# Altium project classyTKL_EC.PrjPcb
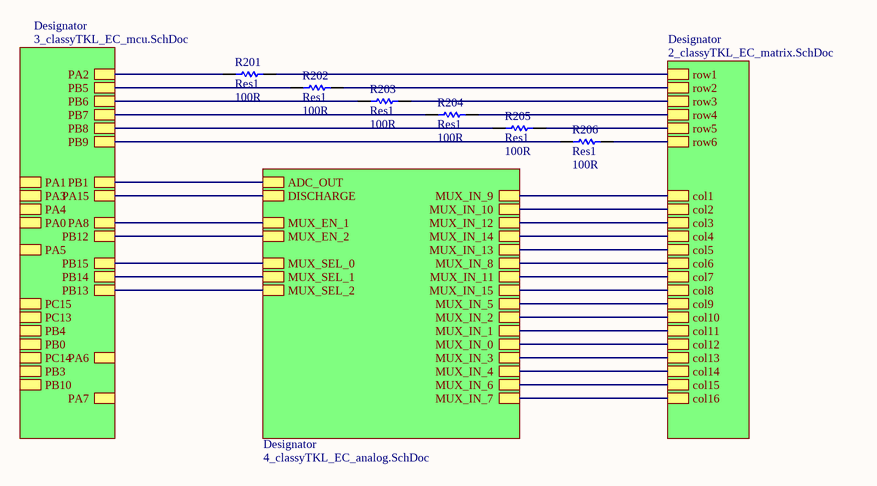
[diagram p0: 1_classyTKL_EC_top.SchDoc]
4 sheets, 156 parts. Net scope: hierarchical (ports join the sheet entries above them; power ports are global).
Board file: classyTKL_EC.PcbDoc
Sheets:
  1_classyTKL_EC_top.SchDoc
    Designator = 3_classyTKL_EC_mcu.SchDoc
    Designator = 2_classyTKL_EC_matrix.SchDoc
    Designator = 4_classyTKL_EC_analog.SchDoc

## Sheet 1_classyTKL_EC_top.SchDoc: ClassyTKL - MX
size A4; Engineer: 4pplet; Address1: github.com/4pplet/classytkl; Address2: Licence: CERN-OHL-S; Revision: A3; SheetNumber: 1; SheetTotal: 3; ProjectName: waffling60

### Parts
R201  Res1  value 100R  [R0603[1608]]
R202  Res1  value 100R  [R0603[1608]]
R203  Res1  value 100R  [R0603[1608]]
R204  Res1  value 100R  [R0603[1608]]
R205  Res1  value 100R  [R0603[1608]]
R206  Res1  value 100R  [R0603[1608]]

### Sub-sheets
Designator = 3_classyTKL_EC_mcu.SchDoc: PB4, PB0, PA0, PA1, PA2, PA3, PA4, PA5, PA15, PB1, PB3, PB5, PB8, PB9, PB10, PB12, PB14, PC13, PC14, PC15, PA8, PA6, PA7, PB6, PB7, PB13, PB15
Designator = 2_classyTKL_EC_matrix.SchDoc: col6, col8, col5, col7, col3, col2, col1, col4, col9, row3, row1, row4, row2, row6, row5, col10, col11, col14, col15, col13, col12, col16
Designator = 4_classyTKL_EC_analog.SchDoc: ADC_OUT, DISCHARGE, MUX_EN_1, MUX_EN_2, MUX_SEL_0, MUX_SEL_1, MUX_SEL_2, MUX_IN_0, MUX_IN_8, MUX_IN_9, MUX_IN_10, MUX_IN_11, MUX_IN_12, MUX_IN_13, MUX_IN_14, MUX_IN_15, MUX_IN_1, MUX_IN_2, MUX_IN_3, MUX_IN_4, MUX_IN_5, MUX_IN_6, MUX_IN_7

### Nets
col1: sheet Designator/col1, sheet Designator/MUX_IN_9
col2: sheet Designator/col2, sheet Designator/MUX_IN_10
col3: sheet Designator/col3, sheet Designator/MUX_IN_12
col4: sheet Designator/col4, sheet Designator/MUX_IN_14
col5: sheet Designator/col5, sheet Designator/MUX_IN_13
col6: sheet Designator/col6, sheet Designator/MUX_IN_8
col7: sheet Designator/col7, sheet Designator/MUX_IN_11
col8: sheet Designator/col8, sheet Designator/MUX_IN_15
col9: sheet Designator/col9, sheet Designator/MUX_IN_5
col10: sheet Designator/col10, sheet Designator/MUX_IN_2
col11: sheet Designator/col11, sheet Designator/MUX_IN_1
col12: sheet Designator/col12, sheet Designator/MUX_IN_0
col13: sheet Designator/col13, sheet Designator/MUX_IN_3
col14: sheet Designator/col14, sheet Designator/MUX_IN_4
col15: sheet Designator/col15, sheet Designator/MUX_IN_6
col16: sheet Designator/col16, sheet Designator/MUX_IN_7
DISCHARGE: sheet Designator/PA15, sheet Designator/DISCHARGE
MUX_EN_1: sheet Designator/PA8, sheet Designator/MUX_EN_1
MUX_EN_2: sheet Designator/PB12, sheet Designator/MUX_EN_2
MUX_SEL_0: sheet Designator/PB15, sheet Designator/MUX_SEL_0
MUX_SEL_1: sheet Designator/PB14, sheet Designator/MUX_SEL_1
MUX_SEL_2: sheet Designator/PB13, sheet Designator/MUX_SEL_2
row1: R201.2 ; sheet Designator/row1
row2: R202.2 ; sheet Designator/row2
row3: R203.2 ; sheet Designator/row3
row4: R204.2 ; sheet Designator/row4
row5: R205.2 ; sheet Designator/row5
row6: R206.2 ; sheet Designator/row6
NetR201_1: R201.1 ; sheet Designator/PA2
NetR202_1: R202.1 ; sheet Designator/PB5
NetR203_1: R203.1 ; sheet Designator/PB6
NetR204_1: R204.1 ; sheet Designator/PB7
NetR205_1: R205.1 ; sheet Designator/PB8
NetR206_1: R206.1 ; sheet Designator/PB9
NetR418_2: sheet Designator/PB1, sheet Designator/ADC_OUT

### Notes on the sheet
- Title
- Size:
- Date:
- A4
- Number:
- Time:
- Revision:
- Sheet
- of
- File:

### Library data of the parts
R201-R206 = Res1: Resistor; MRF.Part: 0603WAF1003T5E; LCSC MFG: Uniroyal Elec; Version: 0603 imperial; LCSC Part #: C25803

## Sheet 3_classyTKL_EC_mcu.SchDoc: =ProjectTitle
size A4; Address1: github.com/4pplet/yakiimo-pcb; Address2: Licence:; SheetNumber: 3; SheetTotal: 3
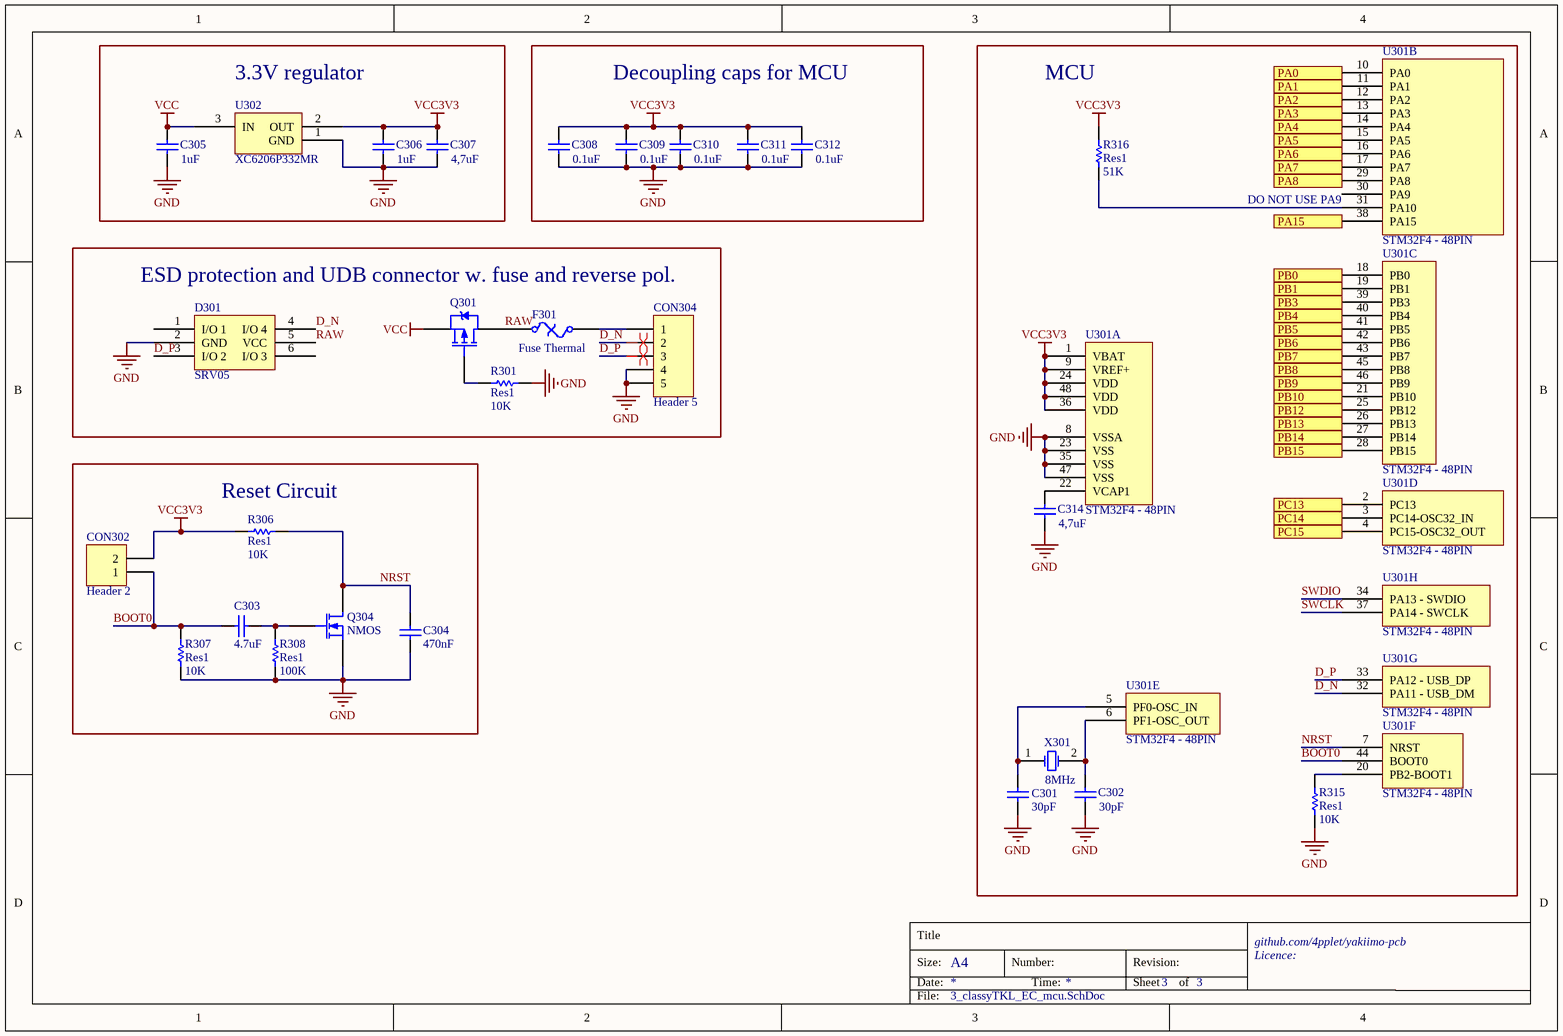
[diagram p1: 3_classyTKL_EC_mcu.SchDoc]

### Parts
C301  value 30pF  [C0603[1608]]
C302  value 30pF  [C0603[1608]]
C303  value 4.7uF  [C0603[1608]]
C304  value 470nF  [C0603[1608]]
C305  value 1uF  [C0603[1608]]
C306  value 1uF  [C0603[1608]]
C307  value 4,7uF  [C0603[1608]]
C308  value 0.1uF  [C0603[1608]]
C309  value 0.1uF  [C0603[1608]]
C310  value 0.1uF  [C0603[1608]]
C311  value 0.1uF  [C0603[1608]]
C312  value 0.1uF  [C0603[1608]]
C314  value 4,7uF  [C0603[1608]]
CON302  Header 2  [HDR1X2]  (no BOM)
CON304  Header 5  [JST SM04B-SRSS-TB]
D301  SRV05  [SOT-23-6]
F301  Fuse Thermal  [C1206[3216]]
Q301  PMOS-2  [SOT-23-3]  (value not drawn)
Q304  NMOS  [SOT-23-3]
R301  Res1  value 10K  [R0603[1608]]
R306  Res1  value 10K  [R0603[1608]]
R307  Res1  value 10K  [R0603[1608]]
R308  Res1  value 100K  [R0603[1608]]
R315  Res1  value 10K  [R0603[1608]]
R316  Res1  value 51K  [R0603[1608]]
U301  STM32F4 - 48PIN  [STM32 - COMBO 7x7mm]  (parts A,B,C,D,E,F,G,H of 8)
U302  XC6206P332MR  [SOT-23-3]
X301  value 8MHz  [CTS 445-series crystal]  (hidden comment: XTAL)

### Blocks framed on the sheet
3.3V regulator: C305-C307 U302
Decoupling caps for MCU: C308-C312
MCU: C301 C302 C314 R315 R316 U301 X301
ESD protection and UDB connector w. fuse and reverse pol.: CON304 D301 F301 Q301 R301
Reset Circuit: C303 C304 CON302 Q304 R306-R308

### Ports
PA0, PA1, PA2, PA3, PA4, PA5, PA6, PA7, PA8, PA15, PB0, PB1, PB3, PB4, PB5, PB6, PB7, PB8, PB9, PB10, PB12, PB13, PB14, PB15, PC13, PC14, PC15

### Nets
GND: C301.1 C302.1 C304.2 C305.1 C306.1 C307.1 C308.1 C309.1 C310.1 C311.1 C312.1 C314.1 CON304.4 CON304.5 D301.2(GND) Q304.2(S) R301.2 R307.2 R308.2 R315.2 U301.8(VSSA) U301.23(VSS) U301.35(VSS) U301.47(VSS) U302.1(GND)
VCC: C305.2 Q301.2(S) U302.3(IN)
VCC3V3: C306.2 C307.2 C308.2 C309.2 C310.2 C311.2 C312.2 CON302.2 R306.1 R316.1 U301.1(VBAT) U301.9(VREF+) U301.24(VDD) U301.36(VDD) U301.48(VDD) U302.2(OUT)
BOOT0: C303.1 CON302.1 R307.1 U301.44(BOOT0)
D_N: CON304.2 D301.4(I/O_4) U301.32(PA11_-_USB_DM)
D_P: CON304.3 D301.3(I/O_2) U301.33(PA12_-_USB_DP)
DISCHARGE: U301.38(PA15) ; port PA15
MUX_EN_1: U301.29(PA8) ; port PA8
MUX_EN_2: U301.25(PB12) ; port PB12
MUX_SEL_0: U301.28(PB15) ; port PB15
MUX_SEL_1: U301.27(PB14) ; port PB14
MUX_SEL_2: U301.26(PB13) ; port PB13
NRST: C304.1 Q304.3(D) R306.2 U301.7(NRST)
RAW: D301.5(VCC) F301.1 Q301.3(D)
SWCLK: U301.37(PA14_-_SWCLK)
SWDIO: U301.34(PA13_-_SWDIO)
NetC301_2: C301.2 U301.5(PF0-OSC_IN) X301.1(OSC1)
NetC302_2: C302.2 U301.6(PF1-OSC_OUT) X301.2(OSC2)
NetC303_2: C303.2 Q304.1(G) R308.1
NetC314_2: C314.2 U301.22(VCAP1)
NetCON304_1: CON304.1 F301.2
NetQ301_1: Q301.1(G) R301.1
NetR201_1: U301.12(PA2) ; port PA2
NetR202_1: U301.41(PB5) ; port PB5
NetR203_1: U301.42(PB6) ; port PB6
NetR204_1: U301.43(PB7) ; port PB7
NetR205_1: U301.45(PB8) ; port PB8
NetR206_1: U301.46(PB9) ; port PB9
NetR315_1: R315.1 U301.20(PB2-BOOT1)
NetR316_2: R316.2 U301.31(PA10)
NetR418_2: U301.19(PB1) ; port PB1
NetU301_2: U301.2(PC13) ; port PC13
NetU301_3: U301.3(PC14-OSC32_IN) ; port PC14
NetU301_4: U301.4(PC15-OSC32_OUT) ; port PC15
NetU301_10: U301.10(PA0) ; port PA0
NetU301_11: U301.11(PA1) ; port PA1
NetU301_13: U301.13(PA3) ; port PA3
NetU301_14: U301.14(PA4) ; port PA4
NetU301_15: U301.15(PA5) ; port PA5
NetU301_16: U301.16(PA6) ; port PA6
NetU301_17: U301.17(PA7) ; port PA7
NetU301_18: U301.18(PB0) ; port PB0
NetU301_21: U301.21(PB10) ; port PB10
NetU301_39: U301.39(PB3) ; port PB3
NetU301_40: U301.40(PB4) ; port PB4

Not connected (* = marked no-connect by the designer): D301 1(I/O_1) 6(I/O_3); U301 30(PA9)

### Layout directives
differential pair: D_N, D_P

### Notes on the sheet
- (near U301) DO NOT USE PA9
- Title
- Size:
- Date:
- A4
- Number:
- Time:
- Revision:
- Sheet
- of
- File:

### Library data of the parts
C301 C302 = Cap: Capacitor; MRF.Part: CL10C300JB8NNNC; LCSC MFG: Samsung Electro-Mechanics; Version: 0603 imperial; LCSC Part #: C22397
C303 C307 C314 = Cap: Capacitor; MRF.Part: CL10A475KO8NNNC; LCSC MFG: Samsung Electro-Mechanics; Version: 0603 imperial; LCSC Part #: C19666
C304 C308-C312 = Cap: Capacitor; MRF.Part: CC0603KRX7R9BB104; LCSC MFG: YAGEO; Version: 0603 imperial; LCSC Part #: C14663
C305 C306 = Cap: Capacitor; MRF.Part: CL10A105KB8NNNC; LCSC MFG: Samsung Electro-Mechanics; Version: 0603 imperial; LCSC Part #: C15849
CON302 = Header 2: Header, 2-Pin; LCSC MFG: DNP; Value: DNP
CON304 = Header 5: JST for USB daughter board; MRF.Part: SM04B-SRSS-TB(LF)(SN); LCSC MFG: JST Sales America; LCSC Part #: C160404
D301 = SRV05: MRF.Part: SRV05-4-P-T7; LCSC MFG: ProTek Devices; LCSC Part #: C85364
F301 = Fuse Thermal: Thermal Fuse; MRF.Part: ASMD1206-050; LCSC MFG: Shenzhen JDT Fuse; LCSC Part #: C135338
Q301 = PMOS-2: P-Channel Power MOSFET; MRF.Part: SI2301CDS-T1-GE3; LCSC MFG: Vishay Intertech; LCSC Part #: C10487; Version: SOT23-3
Q304 = MOSFET-N: N-Channel MOSFET; MRF.Part: 2N7002; LCSC MFG: Changjiang Electronics Tech (CJ); LCSC Part #: C8545
R301 R306 R307 R315 = Res1: Resistor; MRF.Part: 0603WAF1002T5E; LCSC MFG: Uniroyal Elec; Version: 0603 imperial; LCSC Part #: C25804
R308 = Res1: as R201 on sheet 1_classyTKL_EC_top; Version: 0603 imperial; LCSC Part #: C25803
R316 = Res1: Resistor; MRF.Part: 0603WAF5102T5E; LCSC MFG: UNI-ROYAL(Uniroyal Elec); Version: 0603 imperial; LCSC Part #: C23196
U301 = STM32F4 - 48PIN: MRF.Part: STM32F411CEU6; LCSC MFG: STMicroelectronics; LCSC Part #: C60420
U302 = SOT23 LDO: LCSC MFG: Torex Semicon; LCSC Part #: C5446; MRF.Part: XC6206P332MR
X301 = XTAL: Crystal Oscillator; MRF.Part: X50328MSB2GI; LCSC MFG: Yangxing Tech; Version: SMD-5032_2P; LCSC Part #: C115962

## Sheet 2_classyTKL_EC_matrix.SchDoc: ClassyTKL - MX
size A2; Address1: github.com/4pplet/classytkl; Address2: Licence: CERN-OHL-S; Revision: A3; SheetNumber: 2; SheetTotal: 3
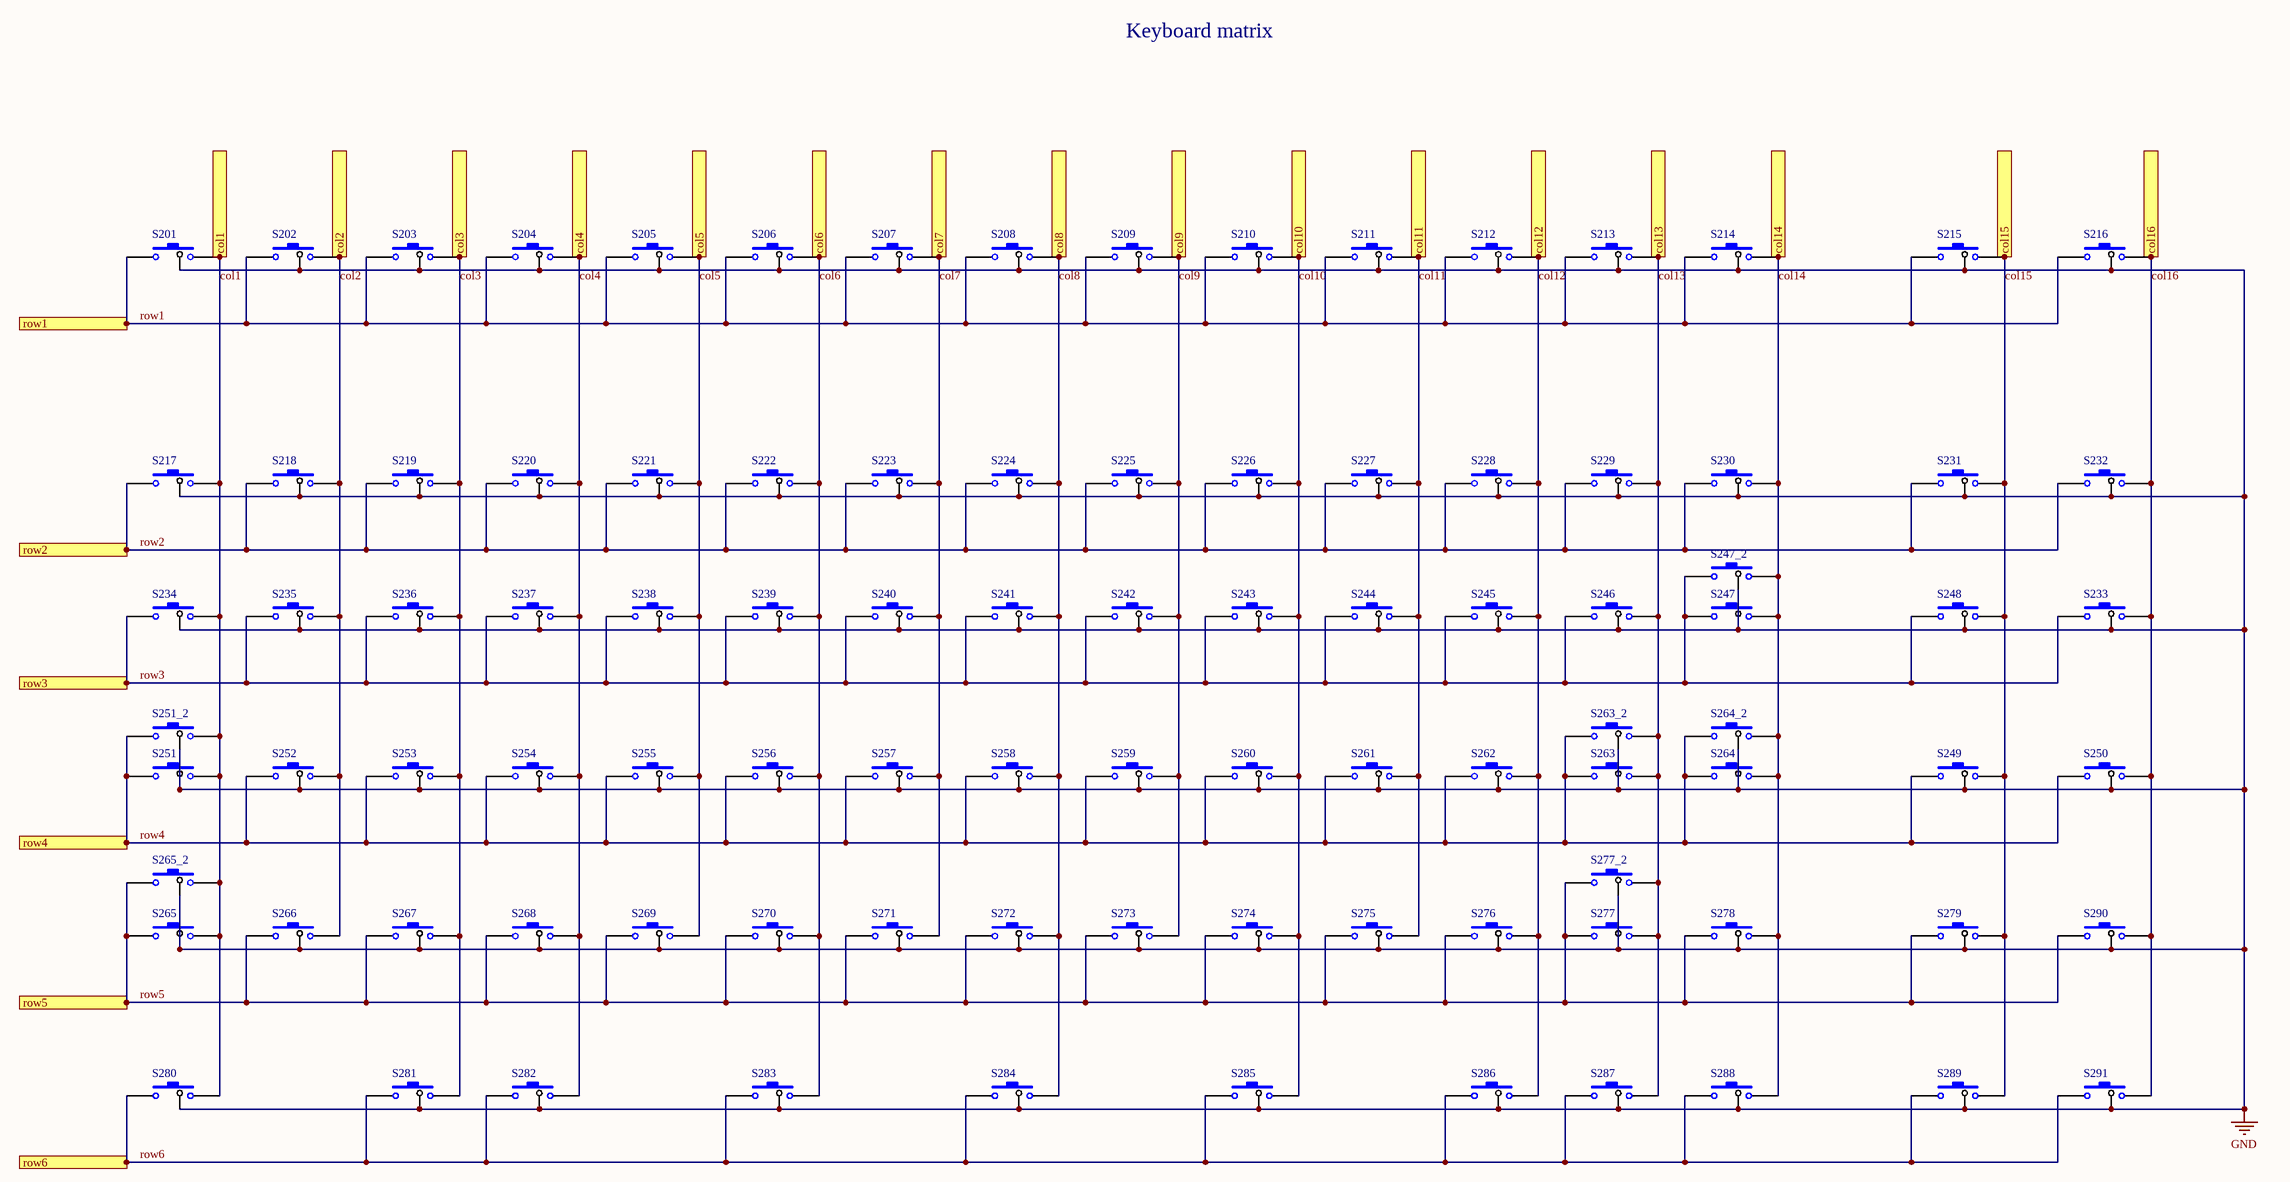
[diagram p2: 2_classyTKL_EC_matrix.SchDoc]

### Parts
S201  SW-PB-3  [Topre]  (value not drawn)
S202  SW-PB-3  [Topre]  (value not drawn)
S203  SW-PB-3  [Topre]  (value not drawn)
S204  SW-PB-3  [Topre]  (value not drawn)
S205  SW-PB-3  [Topre]  (value not drawn)
S206  SW-PB-3  [Topre]  (value not drawn)
S207  SW-PB-3  [Topre]  (value not drawn)
S208  SW-PB-3  [Topre]  (value not drawn)
S209  SW-PB-3  [Topre]  (value not drawn)
S210  SW-PB-3  [Topre]  (value not drawn)
S211  SW-PB-3  [Topre]  (value not drawn)
S212  SW-PB-3  [Topre]  (value not drawn)
S213  SW-PB-3  [Topre]  (value not drawn)
S214  SW-PB-3  [Topre]  (value not drawn)
S215  SW-PB-3  [Topre]  (value not drawn)
S216  SW-PB-3  [Topre]  (value not drawn)
S217  SW-PB-3  [Topre]  (value not drawn)
S218  SW-PB-3  [Topre]  (value not drawn)
S219  SW-PB-3  [Topre]  (value not drawn)
S220  SW-PB-3  [Topre]  (value not drawn)
S221  SW-PB-3  [Topre]  (value not drawn)
S222  SW-PB-3  [Topre]  (value not drawn)
S223  SW-PB-3  [Topre]  (value not drawn)
S224  SW-PB-3  [Topre]  (value not drawn)
S225  SW-PB-3  [Topre]  (value not drawn)
S226  SW-PB-3  [Topre]  (value not drawn)
S227  SW-PB-3  [Topre]  (value not drawn)
S228  SW-PB-3  [Topre]  (value not drawn)
S229  SW-PB-3  [Topre]  (value not drawn)
S230  SW-PB-3  [Topre]  (value not drawn)
S231  SW-PB-3  [Topre]  (value not drawn)
S232  SW-PB-3  [Topre]  (value not drawn)
S233  SW-PB-3  [Topre]  (value not drawn)
S234  SW-PB-3  [Topre]  (value not drawn)
S235  SW-PB-3  [Topre]  (value not drawn)
S236  SW-PB-3  [Topre]  (value not drawn)
S237  SW-PB-3  [Topre]  (value not drawn)
S238  SW-PB-3  [Topre]  (value not drawn)
S239  SW-PB-3  [Topre]  (value not drawn)
S240  SW-PB-3  [Topre]  (value not drawn)
S241  SW-PB-3  [Topre]  (value not drawn)
S242  SW-PB-3  [Topre]  (value not drawn)
S243  SW-PB-3  [Topre]  (value not drawn)
S244  SW-PB-3  [Topre]  (value not drawn)
S245  SW-PB-3  [Topre]  (value not drawn)
S246  SW-PB-3  [Topre]  (value not drawn)
S247  SW-PB-3  [Topre]  (value not drawn)
S247_2  SW-PB-3  [Topre]  (value not drawn)
S248  SW-PB-3  [Topre]  (value not drawn)
S249  SW-PB-3  [Topre]  (value not drawn)
S250  SW-PB-3  [Topre]  (value not drawn)
S251  SW-PB-3  [Topre]  (value not drawn)
S251_2  SW-PB-3  [Topre]  (value not drawn)
S252  SW-PB-3  [Topre]  (value not drawn)
S253  SW-PB-3  [Topre]  (value not drawn)
S254  SW-PB-3  [Topre]  (value not drawn)
S255  SW-PB-3  [Topre]  (value not drawn)
S256  SW-PB-3  [Topre]  (value not drawn)
S257  SW-PB-3  [Topre]  (value not drawn)
S258  SW-PB-3  [Topre]  (value not drawn)
S259  SW-PB-3  [Topre]  (value not drawn)
S260  SW-PB-3  [Topre]  (value not drawn)
S261  SW-PB-3  [Topre]  (value not drawn)
S262  SW-PB-3  [Topre]  (value not drawn)
S263  SW-PB-3  [Topre]  (value not drawn)
S263_2  SW-PB-3  [Topre]  (value not drawn)
S264  SW-PB-3  [Topre]  (value not drawn)
S264_2  SW-PB-3  [Topre]  (value not drawn)
S265  SW-PB-3  [Topre]  (value not drawn)
S265_2  SW-PB-3  [Topre]  (value not drawn)
S266  SW-PB-3  [Topre]  (value not drawn)
S267  SW-PB-3  [Topre]  (value not drawn)
S268  SW-PB-3  [Topre]  (value not drawn)
S269  SW-PB-3  [Topre]  (value not drawn)
S270  SW-PB-3  [Topre]  (value not drawn)
S271  SW-PB-3  [Topre]  (value not drawn)
S272  SW-PB-3  [Topre]  (value not drawn)
S273  SW-PB-3  [Topre]  (value not drawn)
S274  SW-PB-3  [Topre]  (value not drawn)
S275  SW-PB-3  [Topre]  (value not drawn)
S276  SW-PB-3  [Topre]  (value not drawn)
S277  SW-PB-3  [Topre]  (value not drawn)
S277_2  SW-PB-3  [Topre]  (value not drawn)
S278  SW-PB-3  [Topre]  (value not drawn)
S279  SW-PB-3  [Topre]  (value not drawn)
S280  SW-PB-3  [Topre]  (value not drawn)
S281  SW-PB-3  [Topre]  (value not drawn)
S282  SW-PB-3  [Topre]  (value not drawn)
S283  SW-PB-3  [Topre]  (value not drawn)
S284  SW-PB-3  [Topre]  (value not drawn)
S285  SW-PB-3  [Topre]  (value not drawn)
S286  SW-PB-3  [Topre]  (value not drawn)
S287  SW-PB-3  [Topre]  (value not drawn)
S288  SW-PB-3  [Topre]  (value not drawn)
S289  SW-PB-3  [Topre]  (value not drawn)
S290  SW-PB-3  [Topre]  (value not drawn)
S291  SW-PB-3  [Topre]  (value not drawn)

### Ports
col1, col2, col3, col4, col5, col6, col7, col8, col9, col10, col11, col12, col13, col14, col15, col16, row1, row2, row3, row4, row5, row6

### Nets
GND: S201.3 S202.3 S203.3 S204.3 S205.3 S206.3 S207.3 S208.3 S209.3 S210.3 S211.3 S212.3 S213.3 S214.3 S215.3 S216.3 S217.3 S218.3 S219.3 S220.3 S221.3 S222.3 S223.3 S224.3 S225.3 S226.3 S227.3 S228.3 S229.3 S230.3 S231.3 S232.3 S233.3 S234.3 S235.3 S236.3 S237.3 S238.3 S239.3 S240.3 S241.3 S242.3 S243.3 S244.3 S245.3 S246.3 S247.3 S247_2.3 S248.3 S249.3 S250.3 S251.3 S251_2.3 S252.3 S253.3 S254.3 S255.3 S256.3 S257.3 S258.3 S259.3 S260.3 S261.3 S262.3 S263.3 S263_2.3 S264.3 S264_2.3 S265.3 S265_2.3 S266.3 S267.3 S268.3 S269.3 S270.3 S271.3 S272.3 S273.3 S274.3 S275.3 S276.3 S277.3 S277_2.3 S278.3 S279.3 S280.3 S281.3 S282.3 S283.3 S284.3 S285.3 S286.3 S287.3 S288.3 S289.3 S290.3 S291.3
col1: S201.2 S217.2 S234.2 S251.2 S251_2.2 S265.2 S265_2.2 S280.2 ; port col1
col2: S202.2 S218.2 S235.2 S252.2 S266.2 ; port col2
col3: S203.2 S219.2 S236.2 S253.2 S267.2 S281.2 ; port col3
col4: S204.2 S220.2 S237.2 S254.2 S268.2 S282.2 ; port col4
col5: S205.2 S221.2 S238.2 S255.2 S269.2 ; port col5
col6: S206.2 S222.2 S239.2 S256.2 S270.2 S283.2 ; port col6
col7: S207.2 S223.2 S240.2 S257.2 S271.2 ; port col7
col8: S208.2 S224.2 S241.2 S258.2 S272.2 S284.2 ; port col8
col9: S209.2 S225.2 S242.2 S259.2 S273.2 ; port col9
col10: S210.2 S226.2 S243.2 S260.2 S274.2 S285.2 ; port col10
col11: S211.2 S227.2 S244.2 S261.2 S275.2 ; port col11
col12: S212.2 S228.2 S245.2 S262.2 S276.2 S286.2 ; port col12
col13: S213.2 S229.2 S246.2 S263.2 S263_2.2 S277.2 S277_2.2 S287.2 ; port col13
col14: S214.2 S230.2 S247.2 S247_2.2 S264.2 S264_2.2 S278.2 S288.2 ; port col14
col15: S215.2 S231.2 S248.2 S249.2 S279.2 S289.2 ; port col15
col16: S216.2 S232.2 S233.2 S250.2 S290.2 S291.2 ; port col16
row1: S201.1 S202.1 S203.1 S204.1 S205.1 S206.1 S207.1 S208.1 S209.1 S210.1 S211.1 S212.1 S213.1 S214.1 S215.1 S216.1 ; port row1
row2: S217.1 S218.1 S219.1 S220.1 S221.1 S222.1 S223.1 S224.1 S225.1 S226.1 S227.1 S228.1 S229.1 S230.1 S231.1 S232.1 ; port row2
row3: S233.1 S234.1 S235.1 S236.1 S237.1 S238.1 S239.1 S240.1 S241.1 S242.1 S243.1 S244.1 S245.1 S246.1 S247.1 S247_2.1 S248.1 ; port row3
row4: S249.1 S250.1 S251.1 S251_2.1 S252.1 S253.1 S254.1 S255.1 S256.1 S257.1 S258.1 S259.1 S260.1 S261.1 S262.1 S263.1 S263_2.1 S264.1 S264_2.1 ; port row4
row5: S265.1 S265_2.1 S266.1 S267.1 S268.1 S269.1 S270.1 S271.1 S272.1 S273.1 S274.1 S275.1 S276.1 S277.1 S277_2.1 S278.1 S279.1 S290.1 ; port row5
row6: S280.1 S281.1 S282.1 S283.1 S284.1 S285.1 S286.1 S287.1 S288.1 S289.1 S291.1 ; port row6

### Notes on the sheet
- Keyboard matrix
- Title
- Size:
- Date:
- File:
- A2
- Number:
- Time:
- Revision:
- Sheet
- of

### Library data of the parts
S201-S247 S247_2 S248-S251 S251_2 S252-S263 S263_2 S264 S264_2 S265 S265_2 S266-S277 S277_2 S278-S291 = SW-PB-3: Switch; LCSC MFG: DNP; Value: DNP

## Sheet 4_classyTKL_EC_analog.SchDoc: ClassyTKL - MX
size A4; Address1: github.com/4pplet/classytkl; Address2: Licence: CERN-OHL-S; Revision: A3; SheetNumber: 3; SheetTotal: 3
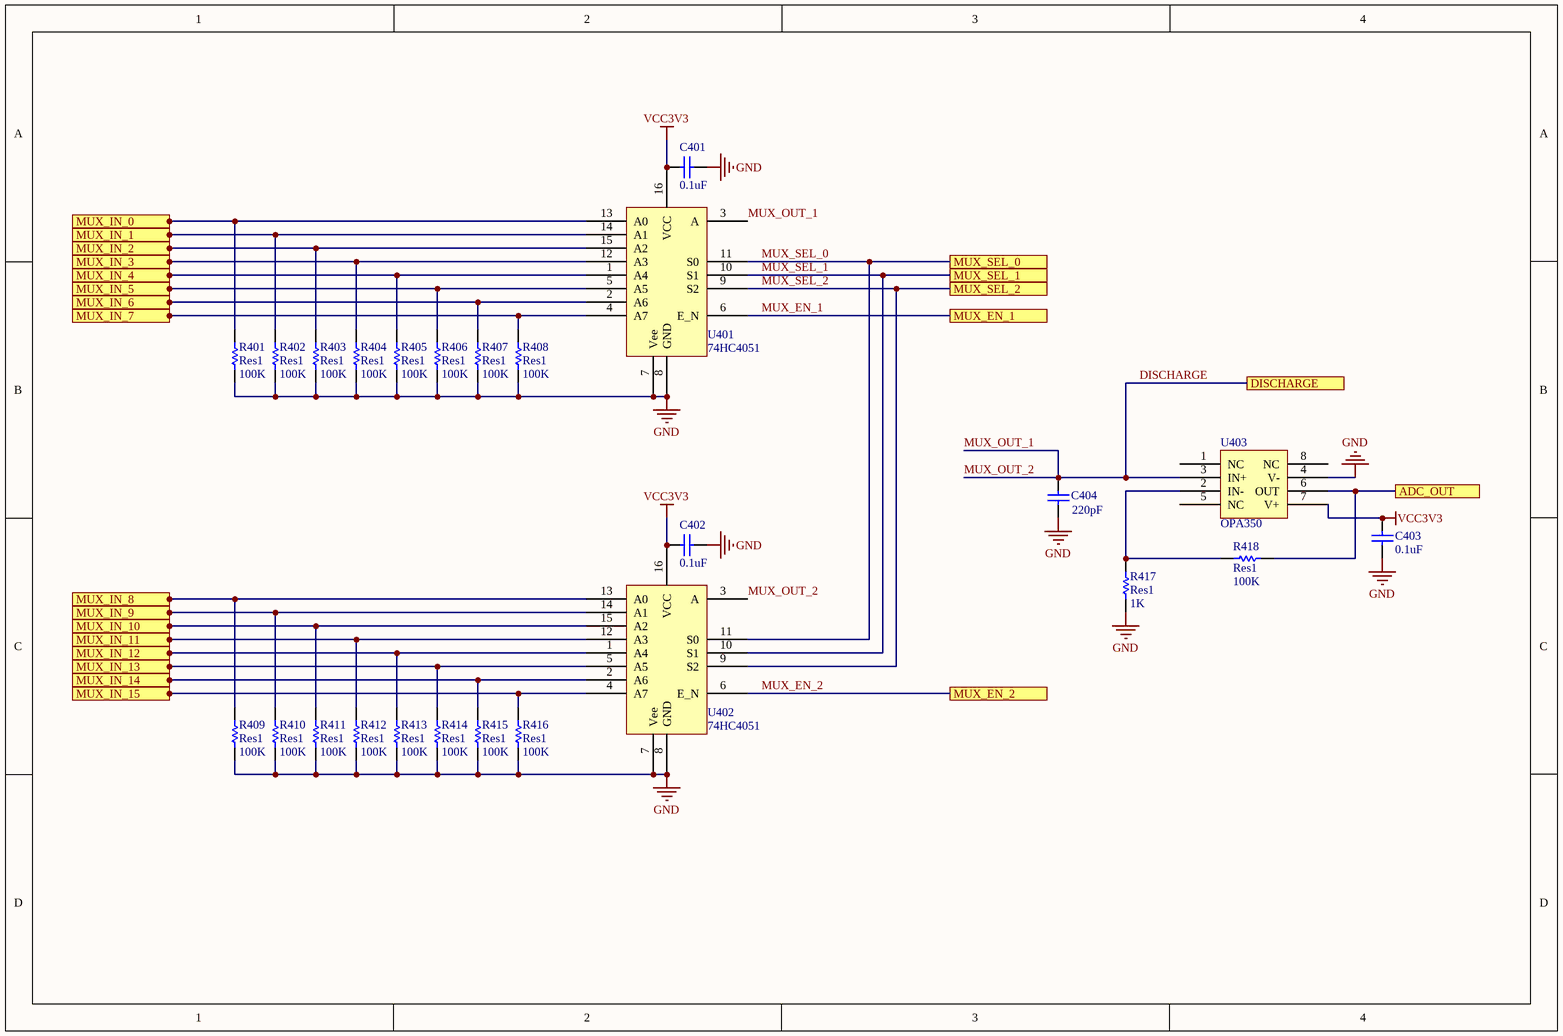
[diagram p3: 4_classyTKL_EC_analog.SchDoc]

### Parts
C401  value 0.1uF  [C0603[1608]]
C402  value 0.1uF  [C0603[1608]]
C403  value 0.1uF  [C0603[1608]]
C404  value 220pF  [C0603[1608]]
R401  Res1  value 100K  [R0603[1608]]
R402  Res1  value 100K  [R0603[1608]]
R403  Res1  value 100K  [R0603[1608]]
R404  Res1  value 100K  [R0603[1608]]
R405  Res1  value 100K  [R0603[1608]]
R406  Res1  value 100K  [R0603[1608]]
R407  Res1  value 100K  [R0603[1608]]
R408  Res1  value 100K  [R0603[1608]]
R409  Res1  value 100K  [R0603[1608]]
R410  Res1  value 100K  [R0603[1608]]
R411  Res1  value 100K  [R0603[1608]]
R412  Res1  value 100K  [R0603[1608]]
R413  Res1  value 100K  [R0603[1608]]
R414  Res1  value 100K  [R0603[1608]]
R415  Res1  value 100K  [R0603[1608]]
R416  Res1  value 100K  [R0603[1608]]
R417  Res1  value 1K  [R0603[1608]]
R418  Res1  value 100K  [R0603[1608]]
U401  74HC4051  [Texas_Instruments_D_SOIC16]
U402  74HC4051  [Texas_Instruments_D_SOIC16]
U403  OPA350  [SOIC-8]

### Ports
ADC_OUT, DISCHARGE, MUX_EN_1, MUX_EN_2, MUX_IN_0, MUX_IN_1, MUX_IN_2, MUX_IN_3, MUX_IN_4, MUX_IN_5, MUX_IN_6, MUX_IN_7, MUX_IN_8, MUX_IN_9, MUX_IN_10, MUX_IN_11, MUX_IN_12, MUX_IN_13, MUX_IN_14, MUX_IN_15, MUX_SEL_0, MUX_SEL_1, MUX_SEL_2

### Nets
GND: C401.1 C402.1 C403.2 C404.1 R401.2 R402.2 R403.2 R404.2 R405.2 R406.2 R407.2 R408.2 R409.2 R410.2 R411.2 R412.2 R413.2 R414.2 R415.2 R416.2 R417.2 U401.7(Vee) U401.8(GND) U402.7(Vee) U402.8(GND) U403.4(V-)
VCC3V3: C401.2 C402.2 C403.1 U401.16(VCC) U402.16(VCC) U403.7(V+)
col1: R410.1 U402.14(A1) ; port MUX_IN_9
col2: R411.1 U402.15(A2) ; port MUX_IN_10
col3: R413.1 U402.1(A4) ; port MUX_IN_12
col4: R415.1 U402.2(A6) ; port MUX_IN_14
col5: R414.1 U402.5(A5) ; port MUX_IN_13
col6: R409.1 U402.13(A0) ; port MUX_IN_8
col7: R412.1 U402.12(A3) ; port MUX_IN_11
col8: R416.1 U402.4(A7) ; port MUX_IN_15
col9: R406.1 U401.5(A5) ; port MUX_IN_5
col10: R403.1 U401.15(A2) ; port MUX_IN_2
col11: R402.1 U401.14(A1) ; port MUX_IN_1
col12: R401.1 U401.13(A0) ; port MUX_IN_0
col13: R404.1 U401.12(A3) ; port MUX_IN_3
col14: R405.1 U401.1(A4) ; port MUX_IN_4
col15: R407.1 U401.2(A6) ; port MUX_IN_6
col16: R408.1 U401.4(A7) ; port MUX_IN_7
DISCHARGE: C404.2 U401.3(A) U402.3(A) U403.3(IN+) ; port DISCHARGE  [also labelled MUX_OUT_1, MUX_OUT_2]
MUX_EN_1: U401.6(E_N) ; port MUX_EN_1
MUX_EN_2: U402.6(E_N) ; port MUX_EN_2
MUX_SEL_0: U401.11(S0) U402.11(S0) ; port MUX_SEL_0
MUX_SEL_1: U401.10(S1) U402.10(S1) ; port MUX_SEL_1
MUX_SEL_2: U401.9(S2) U402.9(S2) ; port MUX_SEL_2
NetR417_1: R417.1 R418.1 U403.2(IN-)
NetR418_2: R418.2 U403.6(OUT) ; port ADC_OUT

Not connected (* = marked no-connect by the designer): U403 1(NC) 5(NC) 8(NC)

### Notes on the sheet
- Title
- Size:
- Date:
- A4
- Number:
- Time:
- Revision:
- Sheet
- of
- File:

### Library data of the parts
C401-C403 = Cap: as C304 on sheet 3_classyTKL_EC_mcu; Version: 0603 imperial; LCSC Part #: C14663
C404 = Cap: Capacitor; MRF.Part: CL10B221KB8NNNC; LCSC MFG: Samsung Electro-Mechanics; Version: 0603 imperial; LCSC Part #: C1603
R401-R416 R418 = Res1: as R201 on sheet 1_classyTKL_EC_top; Version: 0603 imperial; LCSC Part #: C25803
R417 = Res1: Resistor; MRF.Part: 0603WAF1001T5E; LCSC MFG: UNI-ROYAL(Uniroyal Elec); Version: 0603 imperial; LCSC Part #: C21190
U401 U402 = 74HC4051: MRF.Part: 74HC4051D,653; LCSC MFG: Nexperia; LCSC Part #: C9386
U403 = OPA350: MRF.Part: OPA350UA/2K5; LCSC MFG: Texas Instruments; LCSC Part #: C13388

## Nets that join several sheets
GND: 3_classyTKL_EC_mcu (25 pins), 2_classyTKL_EC_matrix (97 pins), 4_classyTKL_EC_analog (26 pins)
VCC3V3: 3_classyTKL_EC_mcu (16 pins), 4_classyTKL_EC_analog (6 pins)
col1: 2_classyTKL_EC_matrix (8 pins), 4_classyTKL_EC_analog (R410.1 U402.14)
col2: 2_classyTKL_EC_matrix (5 pins), 4_classyTKL_EC_analog (R411.1 U402.15)
col3: 2_classyTKL_EC_matrix (6 pins), 4_classyTKL_EC_analog (R413.1 U402.1)
col4: 2_classyTKL_EC_matrix (6 pins), 4_classyTKL_EC_analog (R415.1 U402.2)
col5: 2_classyTKL_EC_matrix (5 pins), 4_classyTKL_EC_analog (R414.1 U402.5)
col6: 2_classyTKL_EC_matrix (6 pins), 4_classyTKL_EC_analog (R409.1 U402.13)
col7: 2_classyTKL_EC_matrix (5 pins), 4_classyTKL_EC_analog (R412.1 U402.12)
col8: 2_classyTKL_EC_matrix (6 pins), 4_classyTKL_EC_analog (R416.1 U402.4)
col9: 2_classyTKL_EC_matrix (5 pins), 4_classyTKL_EC_analog (R406.1 U401.5)
col10: 2_classyTKL_EC_matrix (6 pins), 4_classyTKL_EC_analog (R403.1 U401.15)
col11: 2_classyTKL_EC_matrix (5 pins), 4_classyTKL_EC_analog (R402.1 U401.14)
col12: 2_classyTKL_EC_matrix (6 pins), 4_classyTKL_EC_analog (R401.1 U401.13)
col13: 2_classyTKL_EC_matrix (8 pins), 4_classyTKL_EC_analog (R404.1 U401.12)
col14: 2_classyTKL_EC_matrix (8 pins), 4_classyTKL_EC_analog (R405.1 U401.1)
col15: 2_classyTKL_EC_matrix (6 pins), 4_classyTKL_EC_analog (R407.1 U401.2)
col16: 2_classyTKL_EC_matrix (6 pins), 4_classyTKL_EC_analog (R408.1 U401.4)
DISCHARGE: 3_classyTKL_EC_mcu (U301.38), 4_classyTKL_EC_analog (C404.2 U401.3 U402.3 U403.3)
MUX_EN_1: 3_classyTKL_EC_mcu (U301.29), 4_classyTKL_EC_analog (U401.6)
MUX_EN_2: 3_classyTKL_EC_mcu (U301.25), 4_classyTKL_EC_analog (U402.6)
MUX_SEL_0: 3_classyTKL_EC_mcu (U301.28), 4_classyTKL_EC_analog (U401.11 U402.11)
MUX_SEL_1: 3_classyTKL_EC_mcu (U301.27), 4_classyTKL_EC_analog (U401.10 U402.10)
MUX_SEL_2: 3_classyTKL_EC_mcu (U301.26), 4_classyTKL_EC_analog (U401.9 U402.9)
NetR201_1: 1_classyTKL_EC_top (R201.1), 3_classyTKL_EC_mcu (U301.12)
NetR202_1: 1_classyTKL_EC_top (R202.1), 3_classyTKL_EC_mcu (U301.41)
NetR203_1: 1_classyTKL_EC_top (R203.1), 3_classyTKL_EC_mcu (U301.42)
NetR204_1: 1_classyTKL_EC_top (R204.1), 3_classyTKL_EC_mcu (U301.43)
NetR205_1: 1_classyTKL_EC_top (R205.1), 3_classyTKL_EC_mcu (U301.45)
NetR206_1: 1_classyTKL_EC_top (R206.1), 3_classyTKL_EC_mcu (U301.46)
NetR418_2: 3_classyTKL_EC_mcu (U301.19), 4_classyTKL_EC_analog (R418.2 U403.6)
row1: 1_classyTKL_EC_top (R201.2), 2_classyTKL_EC_matrix (16 pins)
row2: 1_classyTKL_EC_top (R202.2), 2_classyTKL_EC_matrix (16 pins)
row3: 1_classyTKL_EC_top (R203.2), 2_classyTKL_EC_matrix (17 pins)
row4: 1_classyTKL_EC_top (R204.2), 2_classyTKL_EC_matrix (19 pins)
row5: 1_classyTKL_EC_top (R205.2), 2_classyTKL_EC_matrix (18 pins)
row6: 1_classyTKL_EC_top (R206.2), 2_classyTKL_EC_matrix (11 pins)